# EAGLE design led_board_v2-3hole (EAGLE 8.2.2)
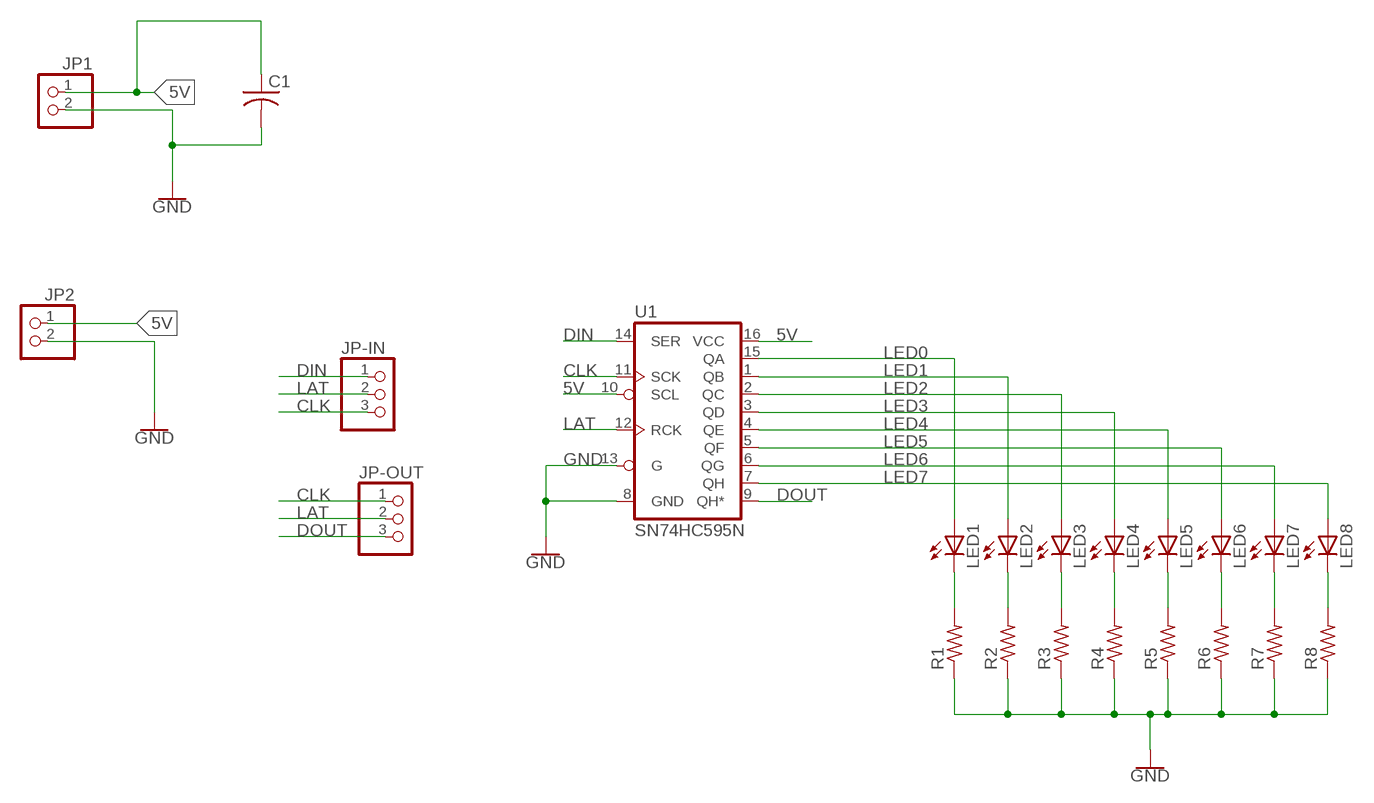
[diagram p0: schematic, sheet 1]

## Parts
C1  C-US025-030X050  [C025-030X050]
JP1  PINHD-1X2  [1X02]
JP2  PINHD-1X2  [1X02]
JP-IN  PINHD-1X3  [1X03]
JP-OUT  PINHD-1X3  [1X03]
LED1  LED3MM  [LED3MM]
LED2  LED3MM  [LED3MM]
LED3  LED3MM  [LED3MM]
LED4  LED3MM  [LED3MM]
LED5  LED3MM  [LED3MM]
LED6  LED3MM  [LED3MM]
LED7  LED3MM  [LED3MM]
LED8  LED3MM  [LED3MM]
R1  R-US_0207/7  [0207/7]
R2  R-US_0207/7  [0207/7]
R3  R-US_0207/7  [0207/7]
R4  R-US_0207/7  [0207/7]
R5  R-US_0207/7  [0207/7]
R6  R-US_0207/7  [0207/7]
R7  R-US_0207/7  [0207/7]
R8  R-US_0207/7  [0207/7]
U1  SN74HC595N  74HC595N  [DIP16]

## Nets
5V: C1.1 JP1.1 JP2.1 U1.10(SCL) U1.16(VCC)
CLK: JP-IN.3 JP-OUT.1 U1.11(SCK)
DIN: JP-IN.1 U1.14(SER)
DOUT: JP-OUT.3 U1.9(QH*)
GND: C1.2 JP1.2 JP2.2 R1.1 R2.1 R3.1 R4.1 R5.1 R6.1 R7.1 R8.1 U1.8(GND) U1.13(G)
LAT: JP-IN.2 JP-OUT.2 U1.12(RCK)
LED0: LED1.A U1.15(QA)
LED1: LED2.A U1.1(QB)
LED2: LED3.A U1.2(QC)
LED3: LED4.A U1.3(QD)
LED4: LED5.A U1.4(QE)
LED5: LED6.A U1.5(QF)
LED6: LED7.A U1.6(QG)
LED7: LED8.A U1.7(QH)
N$1: LED1.K(C) R1.2
N$2: LED2.K(C) R2.2
N$3: LED3.K(C) R3.2
N$4: LED4.K(C) R4.2
N$5: LED5.K(C) R5.2
N$6: LED6.K(C) R6.2
N$7: LED7.K(C) R7.2
N$8: LED8.K(C) R8.2

## Library data of the parts
C1 = adafruit:C-US: CAPACITOR, American symbol
JP1 JP2 = pinhead:PINHD-1X2: PIN HEADER
JP-IN JP-OUT = pinhead:PINHD-1X3: PIN HEADER
LED1-LED8 = adafruit:LED: LED OSRAM: - CHIPLED LG R971, LG N971, LY N971, LG Q971, LY Q971, LO R971, LY R971 LH N974, LH R974 LS Q976, LO Q976, LY Q976 LO Q996 - Hyper CHIPLED LW Q18S LB Q993, LB Q99A, LB R99A - SideLED LS A670, LO A670, LY A670, LG A670, LP A670 LB A673, LV A673, LT A673, LW A673 LH A674 LY A675 LS A676, LA A676, LO A676, LY A676, LW A676 LS A679, LY A679, LG A679 - Hyper Micro SIDELED® LS Y876, LA Y876, LO Y876, LY Y876 LT Y87S - SmartLED LW L88C, LW L88S LB L89C, LB L89S, LG L890 LS L89K, LO L89K, LY L89K LS L896, LA L896, LO L896, LY L896 - TOPLED LS T670, LO T670, LY T670, LG T670, LP T670 LSG T670, LSP T670, LSY T670, LOP T670, LYG T670 LG T671, LOG T671, LSG T671 LB T673, LV T673, LT T673, LW T673 LH T674 LS T676, LA T676, LO T676, LY T676, LB T676, LH T676, LSB T676, LW T676 LB T67C, LV T67C, LT T67C, LS T67K, LO T67K, LY T67K, LW E67C LS E67B, LA E67B, LO E67B, LY E67B, LB E67C, LV E67C, LT E67C LW T67C LS T679, LY T679, LG T679 LS T770, LO T770, LY T770, LG T770, LP T770 LB T773, LV T773, LT T773, LW T773 LH T774 LS E675, LA E675, LY E675, LS T675 LS T776, LA T776, LO T776, LY T776, LB T776 LHGB T686 LT T68C, LB T68C - Hyper Mini TOPLED® LB M676 - Mini TOPLED Santana® LG M470 LS M47K, LO M47K, LY M47K Source: http://www.osram.convergy.de/
R1-R8 = adafruit:R-US_: RESISTOR, American symbol
U1 = SparkFun-IC-Logic:74*595: 8-Bit Shift Register (Serial to Parallel) Datasheet <http://cdn.sparkfun.com/datasheets/BreakoutBoards/MM74HC595.pdf> SparkFun Products SparkFun Shift Register Breakout - 74HC595 <https://www.sparkfun.com/products/10680> (BOB-10680); PROD_ID: IC-13123

## Board
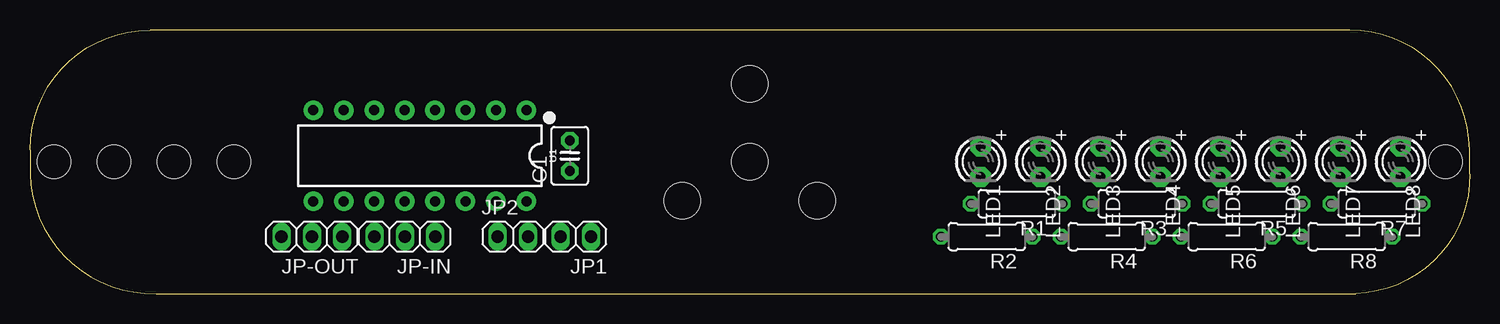
[diagram p1: board, top side]
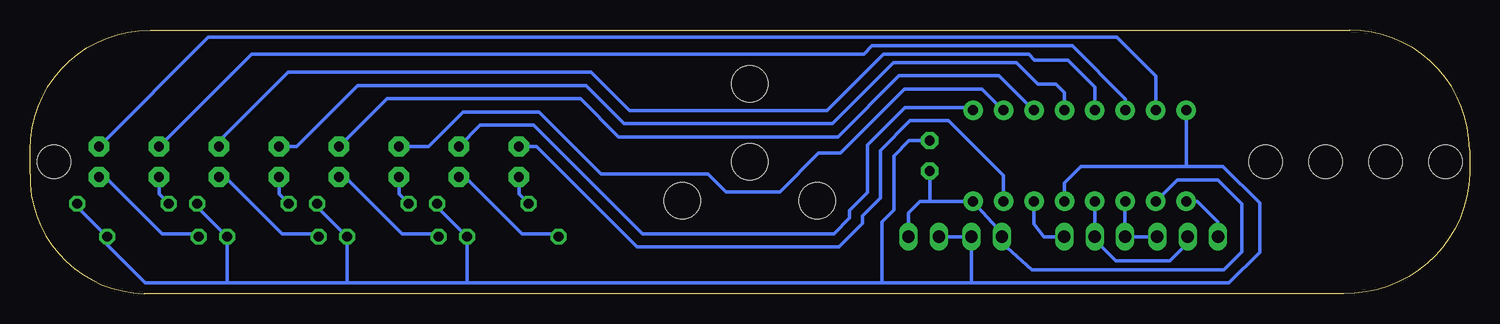
[diagram p2: board, bottom side, seen from below]

Size 120 x 22 mm. Coordinates in mm from the lower left corner, seen from the top.
Outline: 10.5,0 110.5,0 arc90 120,10 120,12 arc90 110,22 10,22 arc90 0,12 0,10 arc90 10.5,0
Copper layers (1*16): Top 0.035mm / dielectric 1.5mm / Bottom 0.035mm
Design rules "OthermillDRC_1_32_v2": minimum track width 8mil, minimum drill 0.8mm, track to track 0.794003125mm, track to pad 0.794003125mm, pad to pad 0.794003125mm, via to via 0.794003125mm, smd to smd 0mil, copper to edge 0mil, drill to drill 1mil, minimum pad ring 10mil, minimum via ring 10mil, stop-mask expansion 1mil, vias tented up to drill 30mil, thermal gap 10mil
Holes 3 mm at 60,11 60,17.5 65.63,7.75 54.37,7.75
Holes 2.75 mm at 7,11 118,11 2,11 12,11 17,11

### Footprints (pad centres in the part's own frame; a part is rotated, then mirrored left to right if it is on the bottom)
C025-030X050 = drill 0.813 pad 1.422 octagon: 1 -1.27,0; 2 1.27,0
1X02 = drill 1.016 long: 1 -1.27,0; 2 1.27,0
1X03 = drill 1.016 long: 1 -2.54,0; 2 0,0; 3 2.54,0
LED3MM = drill 0.813 pad 1.676 octagon: A -1.27,0; K 1.27,0
0207/7 = drill 0.813 octagon: 1 -3.81,0; 2 3.81,0
DIP16 = drill 0.813 pad 1.626: 1 -8.89,-3.81; 2 -6.35,-3.81; 3 -3.81,-3.81; 4 -1.27,-3.81; 5 1.27,-3.81; 6 3.81,-3.81; 7 6.35,-3.81; 8 8.89,-3.81; 9 8.89,3.81; 10 6.35,3.81; 11 3.81,3.81; 12 1.27,3.81; 13 -1.27,3.81; 14 -3.81,3.81; 15 -6.35,3.81; 16 -8.89,3.81

### Placement (x,y rotation side)
C1  45,11.5 90 top
JP1  45.5,4.75 180 top
JP2  40.25,4.75 0 top
JP-IN  31.25,4.75 180 top
JP-OUT  23.5,4.75 180 top
LED1  79.25,11 270 top
LED2  84.25,11 270 top
LED3  89.25,11 270 top
LED4  94.25,11 270 top
LED5  99.25,11 270 top
LED6  104.25,11 270 top
LED7  109.25,11 270 top
LED8  114.25,11 270 top
R1  82.25,7.5 180 top
R2  79.75,4.75 180 top
R3  92.25,7.5 180 top
R4  89.75,4.75 180 top
R5  102.25,7.5 180 top
R6  99.75,4.75 180 top
R7  112.25,7.5 180 top
R8  109.75,4.75 180 top
U1  32.5,11.5 180 top

### Tracks (layer width: path | path; a pad name or v marks a point on that pad's centre or on a via)
5V
  Bottom 0.305: JP1.1 46.77,6.73 45.81,7.69 44.98,7.69 | 44.98,7.69 U1.16 38.98,5.03 JP2.1 38.98,4.23 36.5,2 20.5,2 19,3.5 19,7.5 21,9.5 24.34,9.5 U1.10 | C1.1 45,7.71 44.98,7.69
CLK
  Bottom 0.305: U1.11 28.71,7.67 JP-IN.3 JP-OUT.1
DIN
  Bottom 0.305: U1.14 36.31,5.81 35.5,4.75 JP-IN.1
DOUT
  Bottom 0.305: U1.9 22.69,7.69 21,6 21,4.79 JP-OUT.3
GND
  Bottom 0.305: R1.1 86.06,7.25 R2.1 83.56,0.88 | R3.1 96.06,7.25 R4.1 93.56,0.95 93.64,0.88 | R5.1 106.06,7.25 R6.1 103.56,0.93 103.51,0.88 | R7.1 116.06,7.25 R8.1 113.56,4.06 110.38,0.88 103.51,0.88 | U1.13 33.77,9.23 32.4,10.6 23.6,10.6 | JP1.2 JP2.2 41.52,0.9 41.54,0.88 | C1.2 46.73,12.77 48,11.5 48,7 49,6 49,0.94 49.06,0.88 | 93.64,0.88 103.51,0.88 | 83.56,0.88 93.64,0.88 | 49.06,0.88 41.54,0.88 | 49.06,0.88 83.56,0.88 | 41.54,0.88 36.9,0.88 36.47,0.9 20.05,0.9 17.5,3.45 17.5,7.55 20.55,10.6 23.6,10.6 | U1.8 23.61,10.61 23.6,10.6
LAT
  Bottom 0.305: U1.12 31.25,7.67 JP-IN.2 31.25,4.5 29.5,2.75 25,2.75 23.5,4.25 JP-OUT.2
LED0
  Bottom 0.305: LED1.A 77.77,12.27 69.4,3.9 52.55,3.9 50.6,5.85 50.6,6.5 49.1,8 49.1,11.96 46.63,14.43 43.43,14.43 38.85,9.85 U1.15
LED1
  Bottom 0.305: LED2.A 82.47,14.05 78,14.05 68.95,5 53,5 51.7,6.3 51.7,6.96 50.2,8.46 50.2,12.41 47.08,15.53 41.61,15.53 U1.1
LED2
  Bottom 0.305: LED3.A 86.77,12.27 83.89,15.15 77.55,15.15 72.39,10 63.5,10 62,8.5 57.5,8.5 54.27,11.73 52.43,11.73 47.09,17.07 40.66,17.07 38.9,15.31 U1.2
LED3
  Bottom 0.305: U1.3 36.36,15.31 39.22,18.17 47.55,18.17 52.63,13.08 70.92,13.08 74.09,16.25 90.25,16.25 94.23,12.27 LED4.A
LED4
  Bottom 0.305: LED5.A 97.78,12.27 92.7,17.35 73.64,17.35 70.46,14.18 53.09,14.18 48,19.27 37.77,19.27 36,17.5 34.5,17.5 33.77,16.77 U1.4
LED5
  Bottom 0.305: LED6.A 104.25,12.75 98.5,18.5 73.23,18.5 70.01,15.28 53.55,15.28 48.85,19.97 36.74,19.97 36.27,19.5 33.5,19.5 31.23,17.23 U1.5
LED6
  Bottom 0.305: LED7.A 101.52,20 50.5,20 49.83,20.67 33.12,20.67 28.69,16.24 U1.6
LED7
  Bottom 0.305: LED8.A 105.14,21.38 29.38,21.38 26.15,18.15 U1.7
N$1
  Bottom 0.305: LED1.K 79.25,8.31 R1.2
N$2
  Bottom 0.305: LED2.K 83.73,9.73 79,5 76.19,5 R2.2
N$3
  Bottom 0.305: LED3.K 89.25,8.31 R3.2
N$4
  Bottom 0.305: LED4.K 93.73,9.73 89,5 86.19,5 R4.2
N$5
  Bottom 0.305: LED5.K 99.25,8.31 R5.2
N$6
  Bottom 0.305: LED6.K 103.73,9.73 99,5 96.19,5 R6.2
N$7
  Bottom 0.305: LED7.K 109.25,8.31 R7.2
N$8
  Bottom 0.305: LED8.K 113.73,9.73 109,5 106.19,5 R8.2